# EAGLE design Gadget-Box-mini-pro (EAGLE 6.6.0)

## Sheet 1 of 2
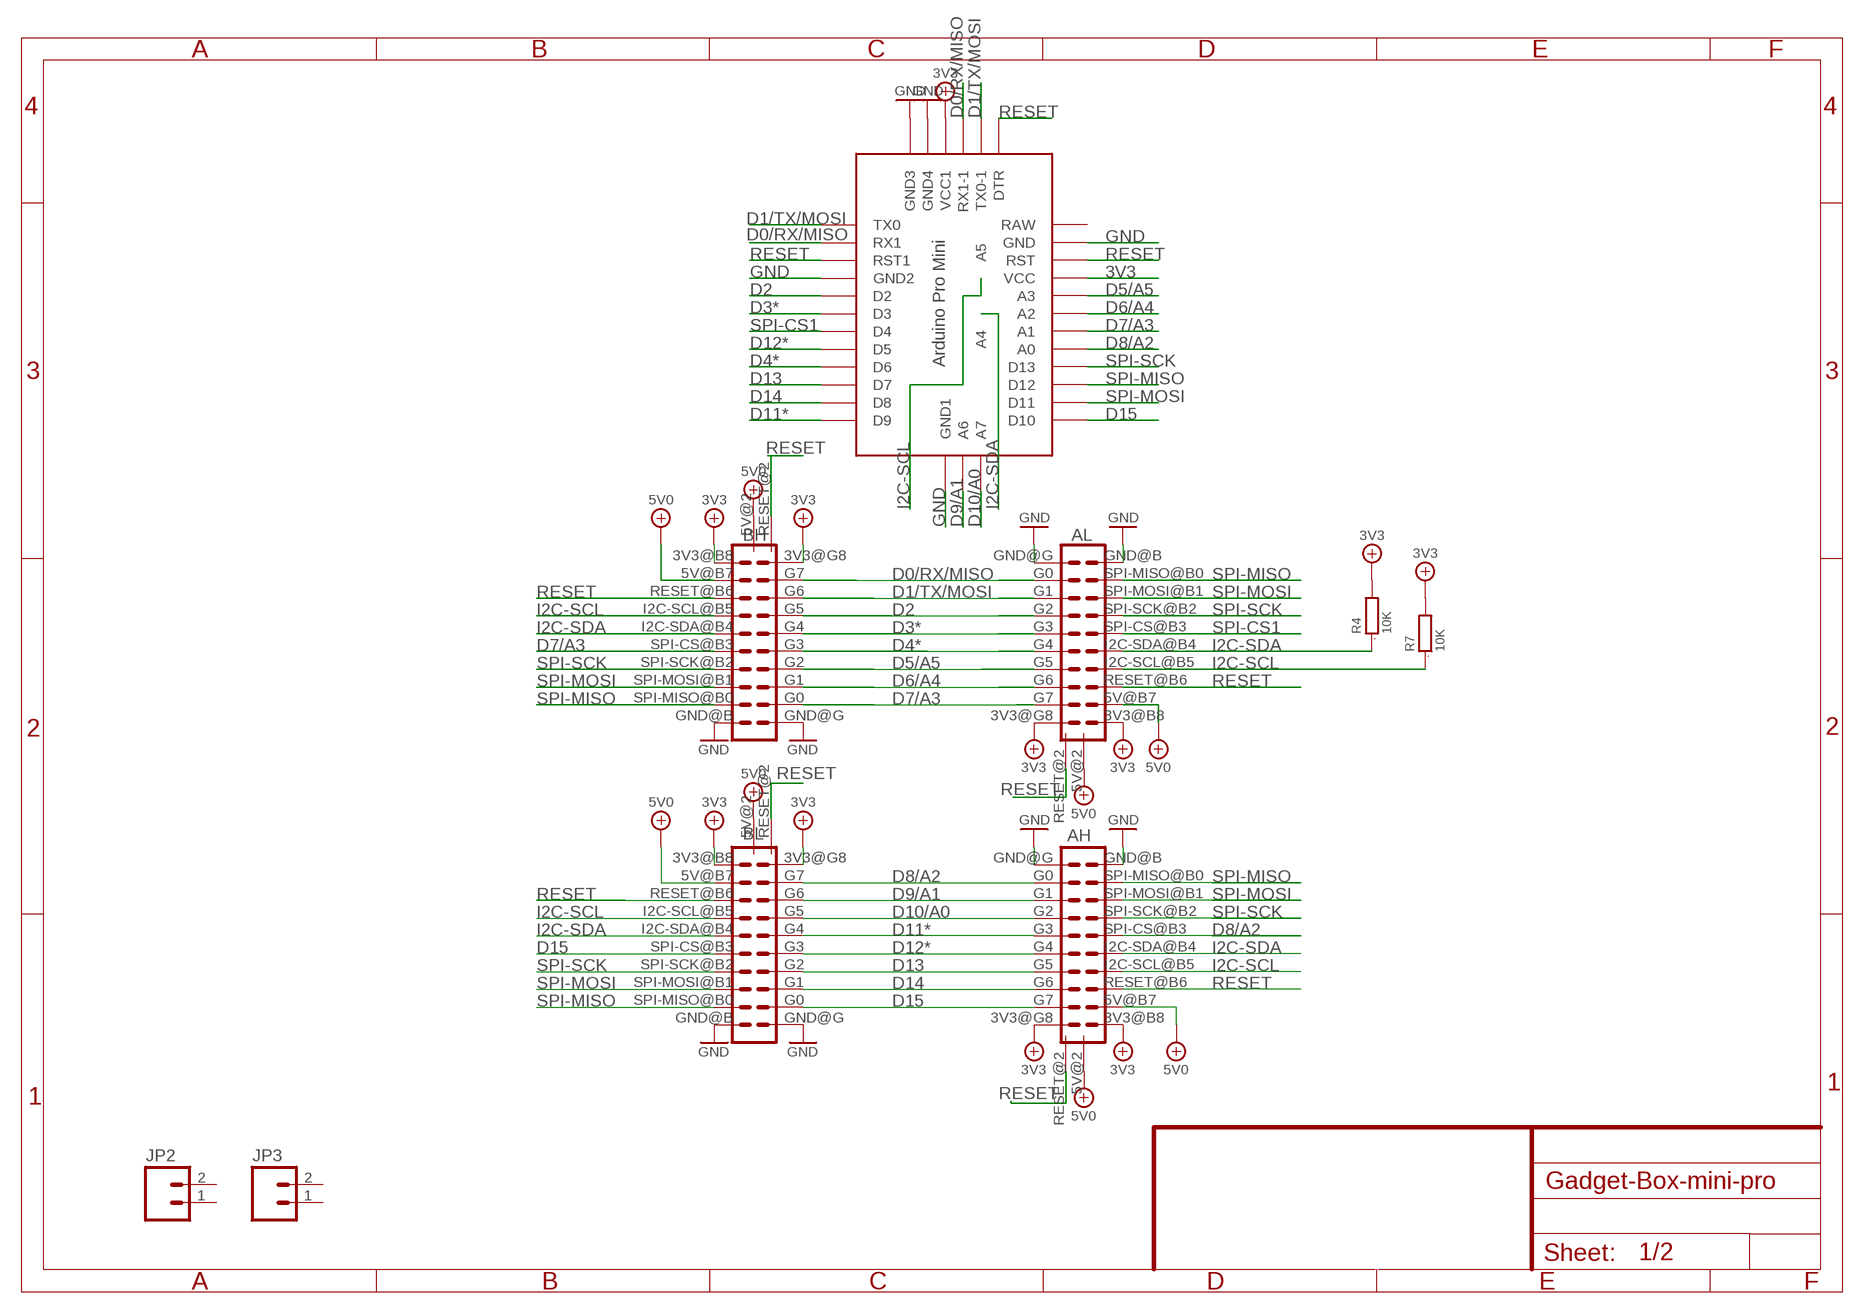
[diagram p0: schematic, sheet 1]

### Parts
AH  ECOGECOG_SLOT_ALT1  [ECOG_ALT1]
AL  ECOGECOG_SLOT_ALT1  [ECOG_ALT1]
BH  ECOGECOG_SLOT_ALT1  [ECOG_ALT1]
BL  ECOGECOG_SLOT_ALT1  [ECOG_ALT1]
JP2  M021X02_NO_SILK  [1X02_NO_SILK]
JP3  M021X02_NO_SILK  [1X02_NO_SILK]
R4  10K  R0805  [0805]
R7  10K  R0805  [0805]
U$1  ABK-PRO-MINI  [ABK-PRO-MINI]

### Nets
3V3: AH.3V3@B8(3V3) AH.3V3@G8(3V3) AL.3V3@B8(3V3) AL.3V3@G8(3V3) BH.3V3@B8(3V3) BH.3V3@G8(3V3) BL.3V3@B8(3V3) BL.3V3@G8(3V3) R4.2 R7.2 U$1.VCC U$1.VCC1 ; also sheet 2
5V0: AH.5V@2(5V) AH.5V@B7(5V) AL.5V@2(5V) AL.5V@B7(5V) BH.5V@2(5V) BH.5V@B7(5V) BL.5V@2(5V) BL.5V@B7(5V) ; also sheet 2
D0/RX/MISO: AL.G0 BH.G7 U$1.RX1 U$1.RX1-1
D1/TX/MOSI: AL.G1 BH.G6 U$1.TX0 U$1.TX0-1
D2: AL.G2 BH.G5 U$1.D2
D3*: AL.G3 BH.G4 U$1.D3
D4*: AL.G4 BH.G3 U$1.D6
D5/A5: AL.G5 BH.G2 U$1.A3 ; also sheet 2
D6/A4: AL.G6 BH.G1 U$1.A2
D7/A3: AL.G7 BH.G0 BH.SPI-CS@B3(SPI-CS) U$1.A1
D8/A2: AH.G0 AH.SPI-CS@B3(SPI-CS) BL.G7 U$1.A0
D9/A1: AH.G1 BL.G6 U$1.A6
D10/A0: AH.G2 BL.G5 U$1.A7
D11*: AH.G3 BL.G4 U$1.D9
D12*: AH.G4 BL.G3 U$1.D5
D13: AH.G5 BL.G2 U$1.D7
D14: AH.G6 BL.G1 U$1.D8
D15: AH.G7 BL.G0 BL.SPI-CS@B3(SPI-CS) U$1.D10
GND [gnd]: AH.GND@B(GND) AH.GND@G(GND) AL.GND@B(GND) AL.GND@G(GND) BH.GND@B(GND) BH.GND@G(GND) BL.GND@B(GND) BL.GND@G(GND) U$1.GND U$1.GND1(GND2) U$1.GND2(GND3) U$1.GND3(GND4) U$1.GND4(GND1) ; also sheet 2
I2C-SCL: AH.I2C-SCL@B5(I2C-SCL) AL.I2C-SCL@B5(I2C-SCL) BH.I2C-SCL@B5(I2C-SCL) BL.I2C-SCL@B5(I2C-SCL) R7.1 U$1.A5
I2C-SDA: AH.I2C-SDA@B4(I2C-SDA) AL.I2C-SDA@B4(I2C-SDA) BH.I2C-SDA@B4(I2C-SDA) BL.I2C-SDA@B4(I2C-SDA) R4.1 U$1.A4
RESET: AH.RESET@2(RESET) AH.RESET@B6(RESET) AL.RESET@2(RESET) AL.RESET@B6(RESET) BH.RESET@2(RESET) BH.RESET@B6(RESET) BL.RESET@2(RESET) BL.RESET@B6(RESET) U$1.DTR U$1.RST U$1.RST1
SPI-CS1: AL.SPI-CS@B3(SPI-CS) U$1.D4
SPI-MISO: AH.SPI-MISO@B0(SPI-MISO) AL.SPI-MISO@B0(SPI-MISO) BH.SPI-MISO@B0(SPI-MISO) BL.SPI-MISO@B0(SPI-MISO) U$1.D12
SPI-MOSI: AH.SPI-MOSI@B1(SPI-MOSI) AL.SPI-MOSI@B1(SPI-MOSI) BH.SPI-MOSI@B1(SPI-MOSI) BL.SPI-MOSI@B1(SPI-MOSI) U$1.D11
SPI-SCK: AH.SPI-SCK@B2(SPI-SCK) AL.SPI-SCK@B2(SPI-SCK) BH.SPI-SCK@B2(SPI-SCK) BL.SPI-SCK@B2(SPI-SCK) U$1.D13
Unconnected: JP2.1 JP2.2 JP3.1 JP3.2 U$1.RAW

## Sheet 2 of 2
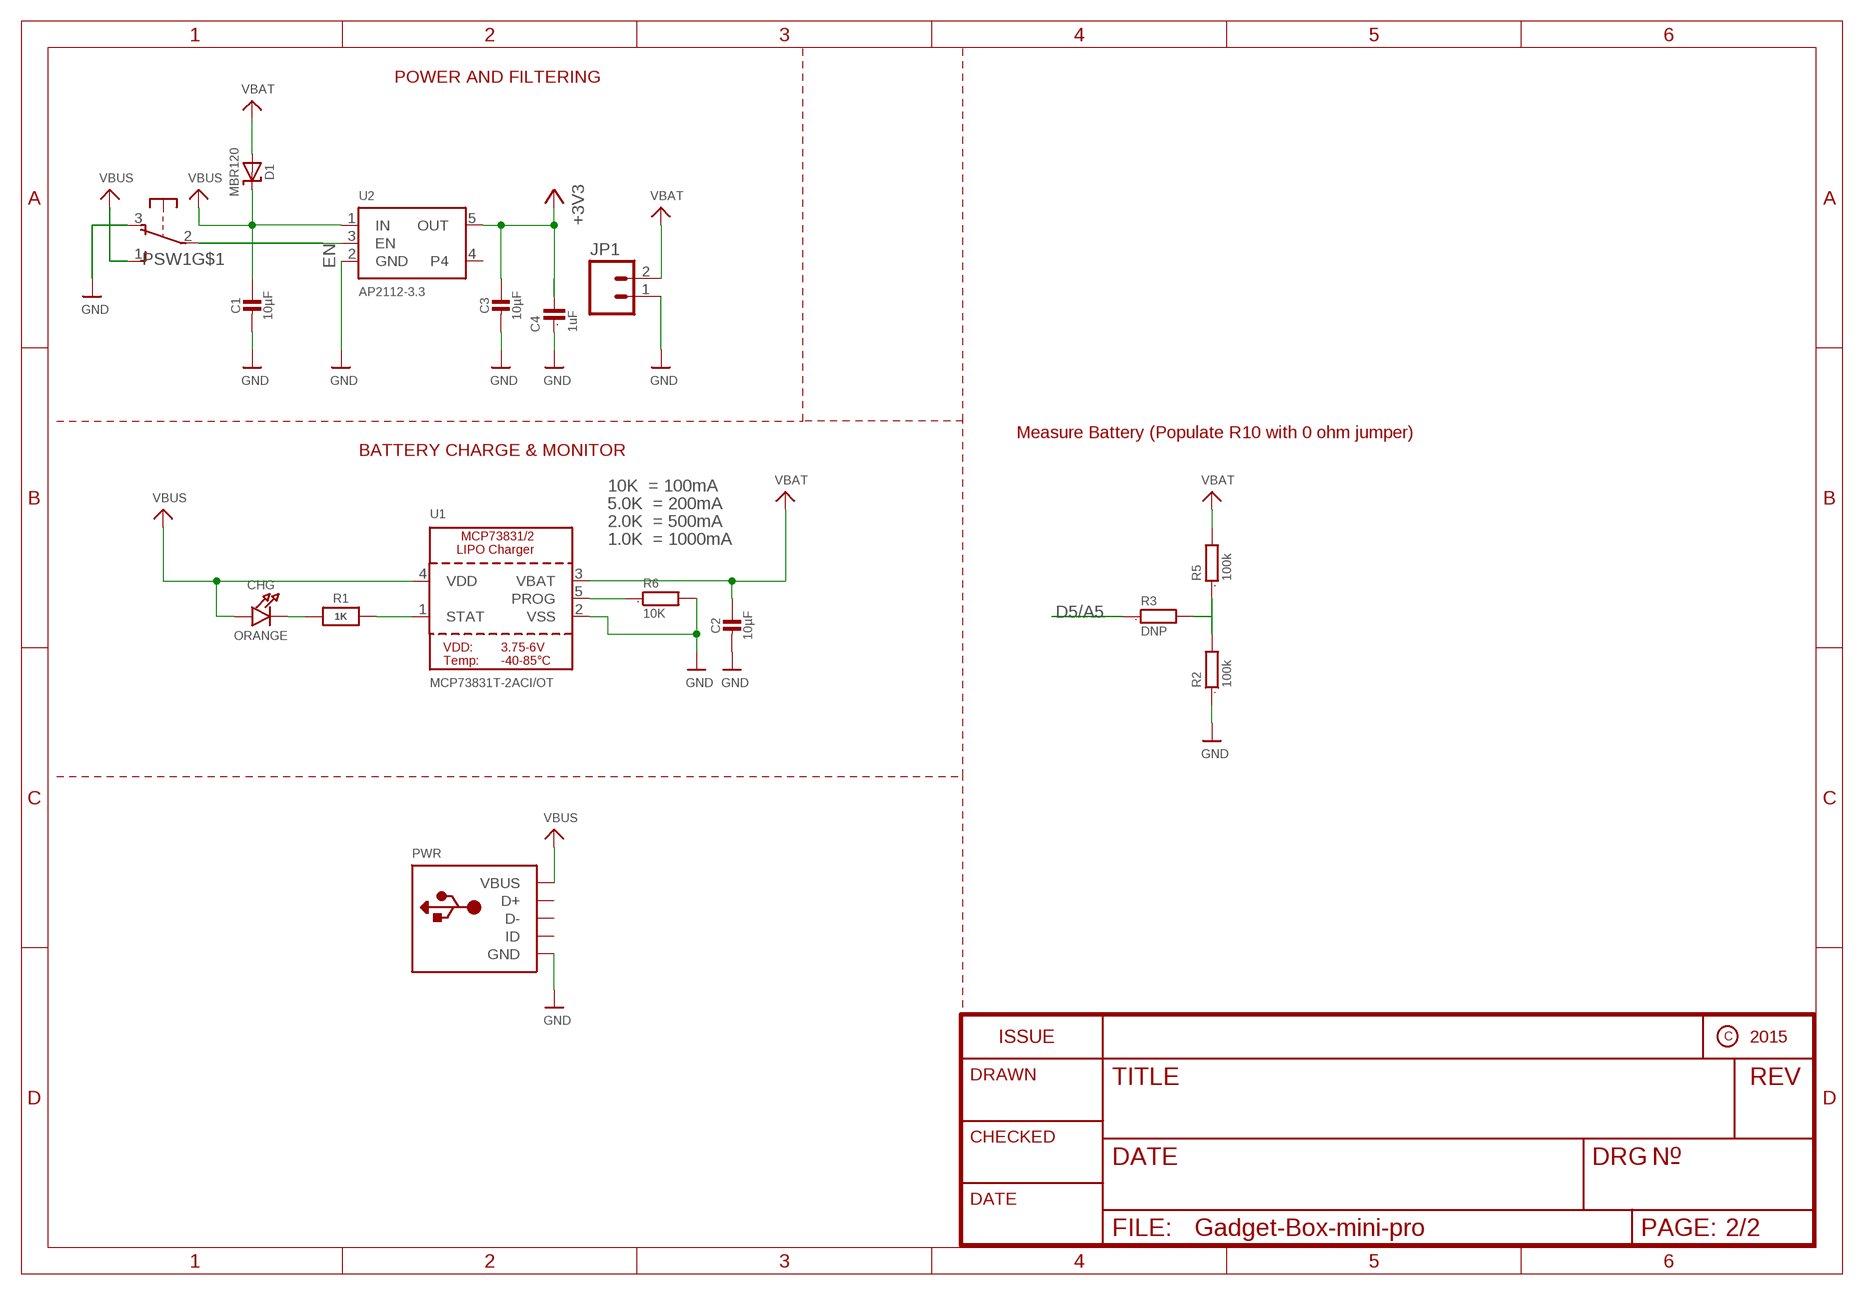
[diagram p1: schematic, sheet 2]

### Parts
C1  10µF  CAP_CERAMIC0805-NOOUTLINE  [0805-NO]
C2  10µF  CAP_CERAMIC0805-NOOUTLINE  [0805-NO]
C3  10µF  CAP_CERAMIC0805-NOOUTLINE  [0805-NO]
C4  1uF  C0603  [0603]
CHG  ORANGE  LED0805_NOOUTLINE  [CHIPLED_0805_NOOUTLINE]
D1  MBR120  DIODE-SCHOTTKYSOD-123  [SOD-123]
JP1  M02-JST-2-PTH-NO_SILK  [JST-2-PTH-NS]
PSW1  OS102011MA1Q  [OS102011MA1Q]
PWR  USBMINIB  [USB-MINIB]
R1  1K  RESISTOR_0603_NOOUT  [0603-NO]
R2  100k  R0603  [0603]
R3  DNP  R0603  [0603]
R5  100k  R0603  [0603]
R6  10K  R0603  [0603]
U1  MCP73831T-2ACI/OT  MCP73831/2  [SOT23-5]
U2  AP2112-3.3  VREG_SOT23-5  [SOT23-5]

### Nets
3V3: C3.1 C4.2 U2.5(OUT) ; supply symbol labelled +3V3 ; also sheet 1
5V0: C1.1 CHG.A D1.C PSW1.1(S) PWR.VBUS U1.4(VDD) U2.1(IN) ; supply symbol labelled VBUS ; also sheet 1
D5/A5: R3.1 ; also sheet 1
EN: PSW1.2(P) U2.3(EN)
GND [gnd]: C1.2 C2.2 C3.2 C4.1 JP1.1 PSW1.3(O) PWR.GND R2.1 R6.2 U1.2(VSS) U2.2(GND) ; also sheet 1
N$1: CHG.C R1.1
N$2: R2.2 R3.2 R5.1
N$3: R1.2 U1.1(STAT)
N$4: R6.1 U1.5(PROG)
VBAT: C2.1 D1.A JP1.2 R5.2 U1.3(VBAT)
Unconnected: PSW1.MT1(MT) PSW1.MT2(MT) PWR.D+ PWR.D- PWR.ID U2.4

### Notes on the sheet
- POWER AND FILTERING
- Measure Battery (Populate R10 with 0 ohm jumper)
- BATTERY CHARGE & MONITOR
- 10K  = 100mA
- 5.0K  = 200mA
- 2.0K  = 500mA
- 1.0K  = 1000mA

## Library data of the parts
AH AL BH BL = eCogs:ECOG; PARTNO: PPPC102LFBN-RC,SULLINS CONNECTOR SOLUTIONS,dk,S6106-ND,"CONN HEADER FEM 20POS.1"" DL GOLD", REF67
C1-C3 = microbuilder:CAP_CERAMIC: Ceramic Capacitors For new designs, use the packages preceded by an '_' character since they are more reliable: The following footprints should be used on most boards: _0402 - Standard footprint for regular board layouts _0603 - Standard footprint for regular board layouts _0805 - Standard footprint for regular board layouts _1206 - Standard footprint for regular board layouts For extremely tight-pitch boards where space is at a premium, the following 'micro-pitch' footprints can be used (smaller pads, no silkscreen outline, etc.): _0402MP - Micro-pitch footprint for very dense/compact boards _0603MP - Micro-pitch footprint for very dense/compact boards _0805MP - Micro-pitch footprint for very dense/compact boards _1206MP - Micro-pitch footprint for very dense/compact boards; PARTNO: CL21F106ZPFNNNE,Samsung,DK,1276-3012-1-ND,CAP CER 10UF 10V Y5V 0805, REF1
C4 = GadgetFactory:C: CAPACITOR, European symbol; PARTNO: C1608X5R1A105K080AC,TDK CORPORATION (VA),dk,445-1321-1-ND,CAP CER 1UF 10V X5R 0603, REF53
CHG = microbuilder:LED: LED 0603 - 0603 Surface Mount Package 2mA: Green LED - Low Power (3.9mcd, 2ma, 1.7Vf) - Digikey: 475-2709-2-ND Orange LED - Low Power (9.8mcd, 2ma, 1.8Vf) - Digikey: 475-1194-2-ND Red LED - Low Power (5mcd, 2ma, 1.8Vf) - Digikey: 475-1195-2-ND Yellow LED - Low Power (7mcd, 2ma, 1.8Vf) - Digikey: 475-1196-2-ND 5mA: Blue LED - Low Power (17mcd, 5ma, 2.9Vf) - Digikey: LNJ937W8CRACT-ND 0805 - 0805 Surface Mount Package 2mA: Red LED (8.8mcd, 2mA, 1.8Vf, Clear) - Low Power [Digikey: 475-2510-1-ND] Green LED (5mcd, 2mA, 1.8Vf, Clear) - Low Power [Digikey: 475-2730-1-ND] Yellow LED (11.3mcd, 2mA, 1.8Vf, Clear) - Low Power [Digikey: 475-2555-1-ND] 20mA: Red LED (104mcd, 20mA, Diffused) - LS R976 [Digikey: 475-1278-6-ND] Red LED (12mcd, 20mA, 2.0Vf, Clear) - APT2012EC [Digikey: 754-1128-1-ND] Green LED (15mcd, 20mA, 2.2Vf, Clear) - APT2012GC [Digikey: 754-1131-1-ND] Orange LED (160mcd, 20mA, 2.1Vf, Clear) - APT2012SECK [Digikey: 754-1130-1-ND] 1206 - 1206 Surface Mount Package Green LED (26mcd, 20mA, Diffused) - LG N971 [Digikey: 475-1407-6-ND] Red LED (15mcd, 20mA, Diffused) - LH N974 [Digikey: 475-1416-6-ND] Cree - Cree High-Power Surface Mount LEDs XPEBWT-L1-0000-00D50 - White 111lm 350mA 2.9Vf 6200K 110° XTEAWT-00-0000-00000LEE3 - White 114lm 350mA 2.85Vf 5000K 115° Everlight - Everlight 45-21 Series Surface Mount LEDs 45-21/QK2C-B2832AC2CB2/2T - Warm White 2000mcd 20mA 3.25Vf 3050K 120° 45-21/LK2C-B38452C4CB2/2T - Nuetral White 2000mcd 20mA 3.25Vf 4150K 120° 45-21/LK2C-B50634C6CB2/2T - Cold White 2200mcd 20mA 3.25Vf 5650K 120° PLCC2 Reverse Mount LS T77K-J1L2-1-0-2-R18-Z - Red 11.25mcd 2mA 1.8Vf 630nm 120° LO T77K-L1M2-24-Z - Orange 19.6mcd 2mA 1.8Vf 606nm 120° LY T77K-K2M1-26-Z - Yellow 15.7mcd 2mA 1.8Vf 587nm 120°; PARTNO: LTST-C171EKT,LITE-ON INC (VA),DK,160-1422-1-ND,LED RED ORAN CLEAR THIN 0805 SMD, REF6
D1 = microbuilder:DIODE-SCHOTTKY; PARTNO: MBR120VLSFT3G,on semiconductor,dk,MBR120VLSFT3GOSCT-ND ,DIODE SCHOTTKY 20V 1A SOD123FL , REF71
JP1-JP3 = SparkFun:M02: Header 2 Standard 2-pin 0.1" header. Use with straight break away headers (SKU : PRT-00116), right angle break away headers (PRT-00553), swiss pins (PRT-00743), machine pins (PRT-00117), and female headers (PRT-00115). Molex polarized connector foot print use with SKU : PRT-08233 with associated crimp pins and housings.
PSW1 = adafruit:OS102011MA1Q: OS10201MA1Q through-hole right angle switch http://www.ladyada.net/library/eagle; PARTNO: OS102011MA1QN1,C&K Components,dk,CKN9559-ND,SWITCH SLIDE SPDT 100MA 12V , REF72
PWR = adafruit:USB: USB Connectors USBMINIB - Surface Mount Female Mini-B USB Connector 4UConnector: 06564 By microbuilder.eu Thru-hole RA Female Mini-B USB Connector 4UConnector: 18732 By ladyada.net
R1 = microbuilder:RESISTOR: Resistors For new designs, use the packages preceded by an '_' character since they are more reliable: The following footprints should be used on most boards: _0402 - Standard footprint for regular board layouts _0603 - Standard footprint for regular board layouts _0805 - Standard footprint for regular board layouts _1206 - Standard footprint for regular board layouts For extremely tight-pitch boards where space is at a premium, the following 'micro-pitch' footprints can be used (smaller pads, no silkscreen outline, etc.): _0402MP - Micro-pitch footprint for very dense/compact boards _0603MP - Micro-pitch footprint for very dense/compact boards _0805MP - Micro-pitch footprint for very dense/compact boards _1206MP - Micro-pitch footprint for very dense/compact boards; PARTNO: RC0603JR-071KL,YAGEO (VA),dk,311-1.0KGRTR-ND,RES SMD 1K OHM 5% 1/10W 0603 , REF73
R2 R5 = GadgetFactory:R: RESISTOR, European symbol; PARTNO: RC0603JR-07100KL,YAGEO (VA),dk,311-100KGRCT-ND,RES SMD 100K OHM 5% 1/10W 0603 , REF76
R3 = GadgetFactory:R: RESISTOR, European symbol; BOM: EXCLUDE
R4 R7 = GadgetFactory:R: RESISTOR, European symbol
R6 = GadgetFactory:R: RESISTOR, European symbol; PARTNO: RC0603JR-0710KL,YAGEO (VA),dk,311-10KGRCT-ND,RES SMD 10K OHM 5% 1/10W 0603 , REF36
U1 = microbuilder:MCP73831/2: MCP73831/2 LIPO Charger VDD: 3.75 - 6V Temp -40 - 85°C Programmable Charge Rate: 15-500mA NOTE: STAT is a tri-state logic output on the MCP73831 and an open-drain output on the MCP73832. SOT23-5 with 4.2V output and tri-state logic on STAT = MCP73831T-2ACI/OT; PARTNO: MCP73831T-2ACI/OT,MICROCHIP TECHNOLOGY (VA),dk,MCP73831T-2ACI/OTCT-ND,IC CONTROLLR LI-ION 4.2V SOT23-5, REF74
U2 = microbuilder:VREG_SOT23-5: SOT23-5 Fixed Voltage Regulators Part Current Out V Out V In V Dropout θJA (°C/W) TJ (°C) Digikey Part No. ADP121 150mA 3.3V 3.4-5.5V 0.09V @ 150mA -- -- ADP121-AUJZ33R7CT-ND ADP121 150mA 3.0V 3.1-5.5V 0.09V @ 150mA -- -- ADP121-AUJZ30R7CT-ND ADP122 300mA 3.3V 3.4-5.5V 0.085V @ 300mA -- -- ADP122AUJZ-3.3-R7CT-ND ADP1712 300mA 3.3V 3.5-5.5V 0.17V @ 300mA -- -- ADP1712AUJZ-3.3-R7TR-ND AP7311 (Low Cost) 150mA 3.3V 3.5-6V 0.15V @ 150mA -- -- AP7311-33WG-7DICT-ND LD39015M18R 150mA 1.8V 1.9V-5.5V 0.08V @ 100mA -- -- 497-6977-1-ND LP2985A-33DBVR 150mA 3.3V 3.3-16V 0.28V @ 150mA 206 150 296-18479-1-ND MCP1824T-3302E/OT 300mA 3.3V 3.5V-6V 0.2V @ 300mA -- -- MCP1824T-3302E/OTCT-ND MIC5205-2.5YM5 TR 150mA 2.5V 2.7-16V 0.165V @ 150mA -- -- 576-1257-2-ND MIC5205-3.0YM5 TR 150mA 3.0V 3.2V-16V 0.165V @ 150mA -- -- 576-1258-2-ND MIC5205-3.3YM5 TR 150mA 3.3V 3.5V-16V 0.165V @ 150mA -- -- 576-1259-2-ND TPS780330220 150mA 3.3V+2.2V 3.6-5.5V 250mV Max -- -- 296-23332-1-ND TDA3663/N1,135 100mA 3.3V 3.5-45V 0.18V @ 50mA -- -- 568-5343-1-ND Max operating temp can be calculated using θJA, TJ (max junction temperature), and power in watts. Set the "Maximum Ambient Temperature" until it reaches TJ ("Max Junction Temperature"), which is the absolute limit for safe use of the regulator: Heat Sink Temperature Calculator <http://www.daycounter.com/Calculators/Heat-Sink-Temperature-Calculator.phtml> For example, With 12V source into a 3.3V LP2985 and a 30mA load, we are dissipating (12V-3.3V) * 0.03A = 0.261W. With a θJA of 206 °C/W, a TJ of 150°C, and 261mW we can safely use the chip without a heat sink up to 75°C (=147.1°C Junction Temperature).; PARTNO: AP2112K-3.3TRG1,Diodes Incorporated,dk,AP2112K-3.3TRG1DICT-ND,IC REG LDO 3.3V 0.6A SOT25 , REF75
U$1 = Arduino-clone:ABK-PRO-MINI: ABK Pro-Mini Arduino Clone; BOM: EXCLUDE

## Net classes
2 gnd: width 0.254 mm, drill 0.381 mm, clearance 0.254 mm
3 usbvcc: width 0.254 mm, drill 0.381 mm, clearance 0.254 mm
4 aref: width 0.254 mm, drill 0.381 mm, clearance 0.254 mm

## Board
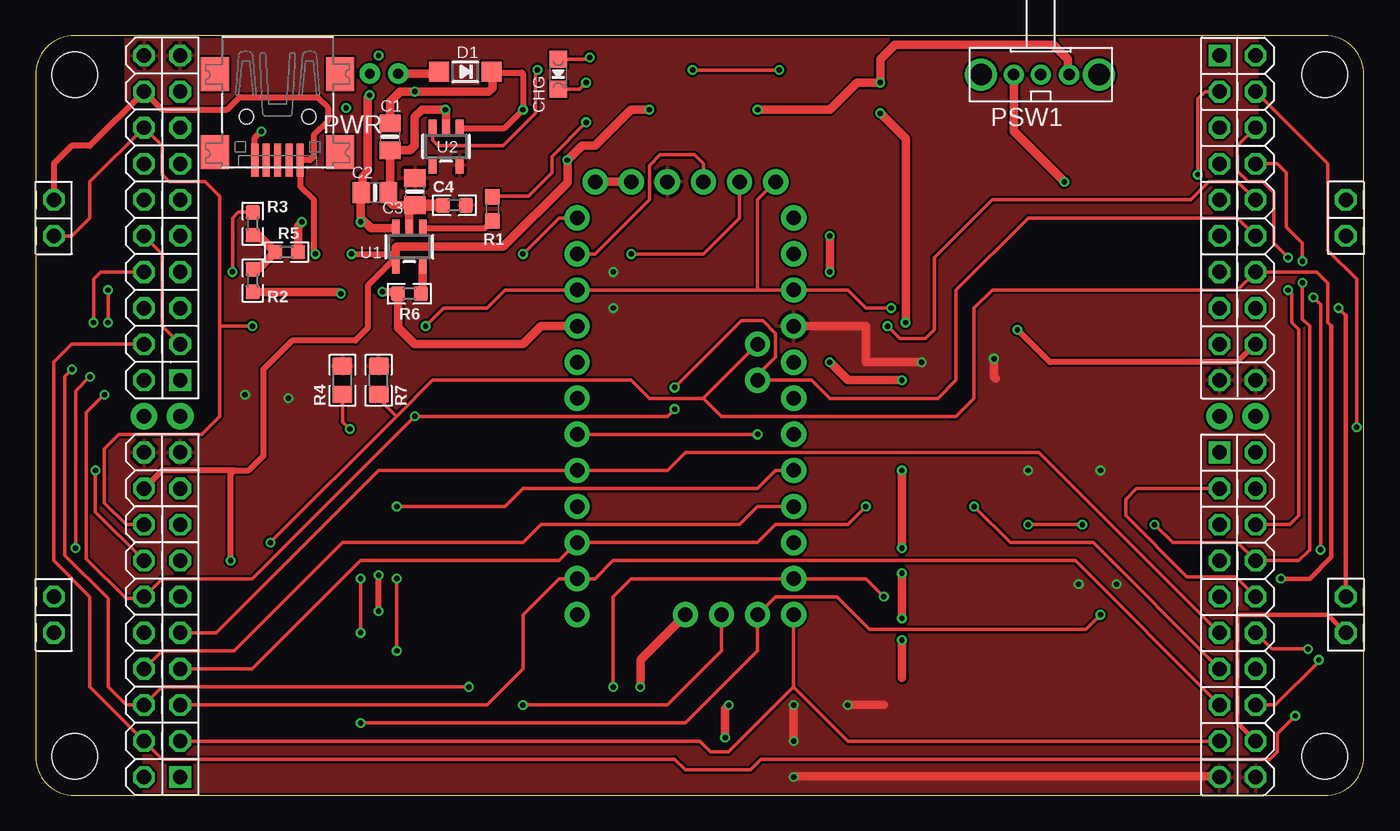
[diagram p2: board, top side]
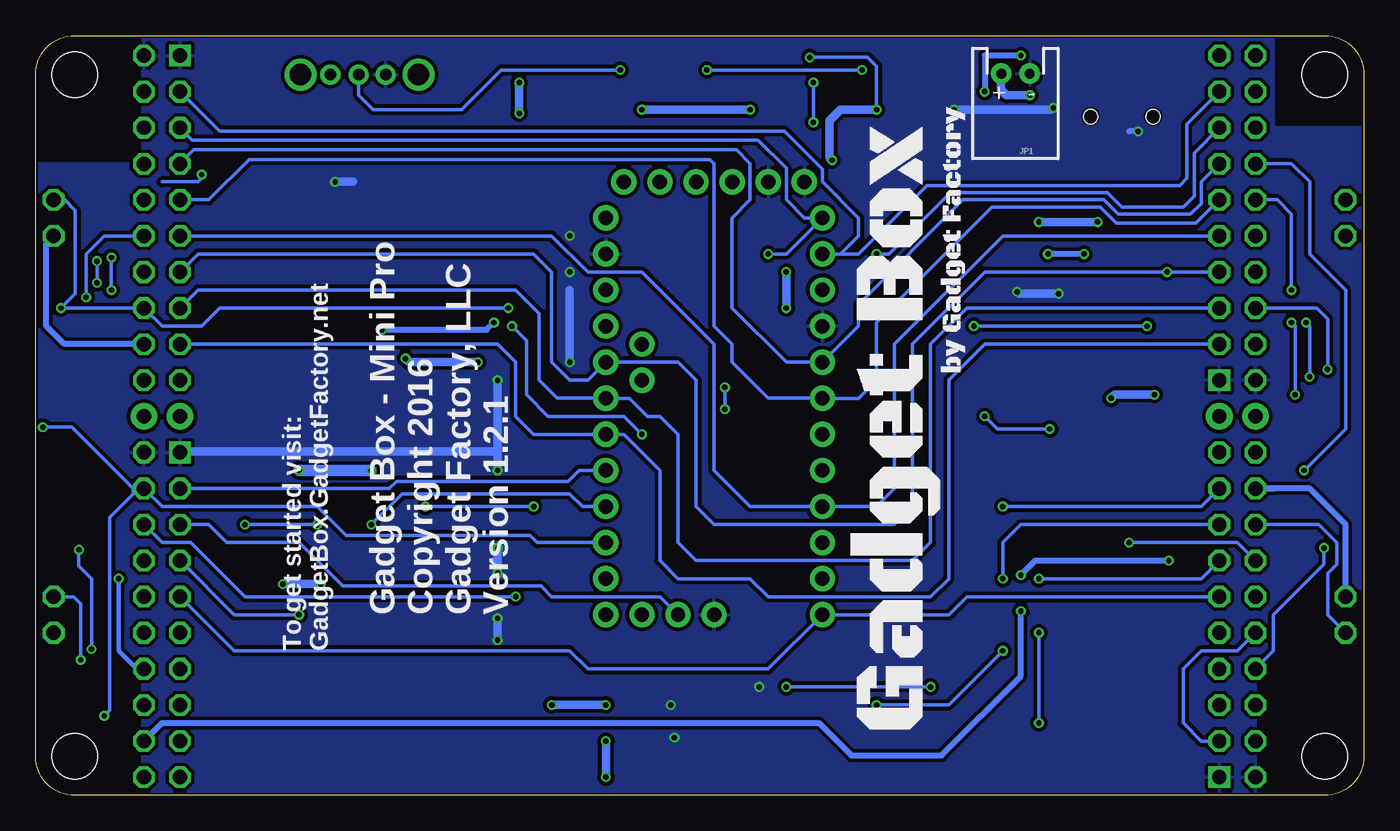
[diagram p3: board, bottom side, seen from below]

Size 93.5 x 53.5 mm. Coordinates in mm from the lower left corner, seen from the top.
Copper layers (1*16): Top 0.035mm / dielectric 1.5mm / Bottom 0.035mm
Design rules "hackvana *": minimum track width 6mil, minimum drill 0.3mm, track to track 6mil, track to pad 6mil, pad to pad 6mil, via to via 6mil, smd to smd 0mil, copper to edge 6mil, drill to drill 6mil, minimum pad ring 10mil, minimum via ring 6mil, stop-mask expansion 2mil, vias tented up to drill 100mil, thermal gap 10mil

### Footprints (pad centres in the part's own frame; a part is rotated, then mirrored left to right if it is on the bottom)
ECOG93P53P5 = hole 3.2: 4,4; 92,4; 92,52; 4,52
ECOG_ALT1 = drill 1.016 octagon: 3V3@B8 21.59,3.81; 3V3@G8 21.59,1.27; 5V@2 11.43,10.16; 5V@B7 19.05,3.81; G0 1.27,1.27; G1 3.81,1.27; G2 6.35,1.27; G3 8.89,1.27; G4 11.43,1.27; G5 13.97,1.27; G6 16.51,1.27; G7 19.05,1.27; GND@B -1.27,3.81; I2C-SCL@B5 13.97,3.81; I2C-SDA@B4 11.43,3.81; RESET@2 8.89,10.16; RESET@B6 16.51,3.81; SPI-CS@B3 8.89,3.81; SPI-MISO@B0 1.27,3.81; SPI-MOSI@B1 3.81,3.81; SPI-SCK@B2 6.35,3.81 | drill 1.016 square: GND@G -1.27,1.27
0805-NO = smd 1.24 x 1.5: 1 -0.95,0; 2 0.95,0
0603 = smd 1 x 1: 1 -0.8,0; 2 0.8,0
CHIPLED_0805_NOOUTLINE = smd 1.2 x 1.2: A 0,-1.05; C 0,1.05
SOD-123 = smd 1.4 x 1.4: A 1.85,0; C -1.85,0
JST-2-PTH-NS = drill 0.7 pad 1.448: 1 -1,0; 2 1,0
1X02_NO_SILK = drill 1.016 pad 1.88: 1 0,0; 2 2.54,0
OS102011MA1Q = drill 0.8 pad 1.422: 1 -2,0; 2 0,0; 3 1.9,0 | drill 1.5 pad 2.184: MT1 -4.1,0; MT2 4.2,0
USB-MINIB = smd 0.5 x 2.308: D+ 0,4.064; D- -0.8,4.064; GND 1.6,4.064; ID 0.8,4.064; VBUS -1.6,4.064 | smd 2 x 2.4: GND1 -4.4,-2; GND2 -4.4,3.5; GND3 4.4,3.5; GND4 4.4,-2 | hole 1: -2.2,1; 2.2,1
0603-NO = smd 1.1 x 1: 1 -0.85,0; 2 0.85,0
0805 = smd 1.2 x 1.4: 1 -1,0; 2 1,0
SOT23-5 = smd 0.55 x 1.2: 1 -0.95,-1.3; 2 0,-1.3; 3 0.95,-1.3; 4 0.95,1.3; 5 -0.95,1.3
ABK-PRO-MINI = drill 1.016 pad 1.778: A0 10.16,-11.43; A1 10.16,-8.89; A2 10.16,-6.35; A3 10.16,-3.81; A4 7.62,-5.08; A5 7.62,-2.54; A6 5.08,-21.59; A7 7.62,-21.59; D2 -5.08,-3.81; D3 -5.08,-6.35; D4 -5.08,-8.89; D5 -5.08,-11.43; D6 -5.08,-13.97; D7 -5.08,-16.51; D8 -5.08,-19.05; D9 -5.08,-21.59; D10 10.16,-21.59; D11 10.16,-19.05; D12 10.16,-16.51; D13 10.16,-13.97; DTR 8.89,8.89; GND 10.16,3.81; GND1 -5.08,-1.27; GND2 -3.81,8.89; GND3 -1.27,8.89; GND4 2.54,-21.59; RAW 10.16,6.35; RST 10.16,1.27; RST1 -5.08,1.27; RX1 -5.08,3.81; RX1-1 3.81,8.89; TX0 -5.08,6.35; TX0-1 6.35,8.89; VCC 10.16,-1.27; VCC1 1.27,8.89

### Placement (x,y rotation side)
$$U$1  [ECOG93P53P5]  -1.25,-1.25 0 top
AH  82.06,22.88 270 top
AL  82.06,50.82 270 top
BH  11.45,30.5 90 top
BL  11.45,2.56 90 top
C1  24.95,46.37 270 top
C2  23.9,42.44 0 top
C3  26.7,42.51 270 top
C4  29.48,41.55 0 top
CHG  36.79,50.78 180 top
D1  30.25,50.95 180 top
JP1  24.53,50.82 180 bottom
JP2  7.64,26.69 0 top
JP3  83.33,26.69 0 top
PSW1  70.75,50.75 180 top
PWR  17.04,48.79 180 top
R1  32.15,41.3 270 top
R2  15.29,36.25 90 top
R3  15.29,40.25 270 top
R4  21.61,29.23 90 top
R5  17.67,38.25 0 top
R6  26.31,35.33 180 top
R7  24.15,29.23 90 top
U1  26.31,38.63 180 top
U2  28.9,45.69 180 top
U$1  43.2,34.31 0 top
U$100  [GADGETBOX_TEXT]  32.79,25.93 90 bottom

### Tracks (layer width: path | path; a pad name or v marks a point on that pad's centre or on a via)
3V3  (via drill 0.38)
  Top 0.61: v67.46,30.75 67.46,29.48 67.58,29.36 | v53.36,1.29 53.41,1.34 83.28,1.34 AH.3V3@G8 | v53.36,3.83 v53.36,6.37 | v57.17,6.37 59.71,6.37 | U$1.VCC 58.44,33.04 58.44,30.5 v62.38,30.5
  Bottom 0.61: v62.38,30.5 67.2,30.5 v67.46,30.75 | v53.36,1.29 v53.36,3.83 | v53.36,6.37 v57.17,6.37 | v73.43,14.88 v76.09,14.88 | v14.75,28.21 17.55,28.21 v17.8,27.96 | v40.66,36.85 v40.66,34.31
  Bottom 0.813: v74.95,22.88 v69.87,22.88
  pour Top: -1.25,8.37 -1.25,47.03 6.37,47.03 6.37,54.63 85.95,54.63 85.95,45.01 94.92,45.01 94.92,8.37 85.95,8.37 85.95,-1.25 7.64,-1.25 7.64,8.37
5V0  (via drill 0.38)
  Top 0.254: CHG.A 38.87,51.83 v39.01,51.96
  Top 0.305: AH.5V@B7 84.6,5.1 84.6,12.72 90.95,12.72 AH.5V@2
  Top 0.406: U2.1 33.02,46.99 v34.31,48.28 34.31,50.82 34.24,50.89 32.15,50.89 | 13.99,22.88 15.01,22.88 16.02,23.9 16.02,29.99 18.05,32.02 22.5,32.02 23.39,32.91 23.39,35.9 25.33,37.83 | 25.33,37.83 25.36,37.87 | v24.15,12.97 v24.15,15.51 | v13.74,16.53 13.74,22.63 13.99,22.88 | v69.11,32.79 71.39,30.5 84.6,30.5 AL.5V@B7 | 13.99,22.88 8.91,22.88 BL.5V@B7 | BH.5V@2 1.29,44.47 2.56,45.74 3.83,45.74 BH.5V@B7 8.91,48.28 13.48,48.28 14.37,49.17 19.83,49.17 20.59,48.41 20.59,47.52 19.58,46.5 19.58,44.98 19.32,44.72 PWR.VBUS 18.64,42.87 19.58,41.93 19.58,38.25 v19.7,38.12 | v22.25,38.12 25.04,38.12 25.33,37.83
  Top 0.61: U1.4 25.36,37.87 25.36,38.57 25.42,38.63 32.91,38.63 37.43,43.15 v37.43,44.72 38.45,45.74 39.39,45.74 41.93,48.28 v43.2,48.28 | C1.1 24.95,48.83 25.67,49.55 v26.69,49.55 31.9,49.55 32.15,49.8 32.15,50.89 D1.C | v61.23,33.29 61.25,33.31 61.25,46.23 v59.46,48.03 | PSW1.1 72.66,50.84 72.66,51.84 71.65,52.85 60.47,52.85 59.46,51.84 v59.46,50.19 57.8,50.19 55.9,48.28 v50.82,48.28
  Bottom 0.254: v39.01,51.96 34.95,51.96 34.31,51.33 v34.31,48.28
  Bottom 0.406: v24.15,52.09 26.69,52.09 v26.69,49.55 | v69.11,32.79 61.74,32.79 v61.23,33.29 | v24.15,12.97 24.15,8.4 29.74,2.81 36.09,2.81 38.37,5.1 84.6,5.1 AH.5V@B7 | v24.15,15.51 23.13,16.53 v13.74,16.53 | 6.37,21.61 BL.5V@B7 3.83,21.61 1.29,19.07 BL.5V@2 | AL.5V@B7 85.93,31.83 91.52,31.83 92.73,33.04 92.73,38.88 AL.5V@2 | v19.7,38.12 v22.25,38.12
  Bottom 0.61: v34.31,48.28 36.85,48.28 37.61,47.52 37.61,44.9 v37.43,44.72 | v59.46,48.03 v59.46,50.19 | v50.82,48.28 v43.2,48.28
D0/RX/MISO  (via drill 0.38)
  Top 0.254: v81.81,43.71 81.81,49.04 82.32,49.55 AL.G0 | U$1.RX1 39.39,38.12 43.2,41.93 43.2,44.34 43.96,45.1 46.38,45.1 47.01,44.47 U$1.RX1-1
  Bottom 0.254: 9.96,49.55 BH.G7 12.47,47.26 12.47,43.45 12.97,42.95 30.75,42.95 35.58,38.12 36.85,38.12 | v81.81,43.71 81.81,43.45 82.06,43.2 84.6,43.2 | AL.G0 80.54,46.76 40.79,46.76 38.12,44.09 38.12,43.2 35.58,40.66 35.58,39.39 36.85,38.12 | 36.85,38.12 U$1.RX1
D1/TX/MOSI  (via drill 0.38)
  Top 0.254: v34.31,38.12 36.85,40.66 U$1.TX0 | U$1.TX0-1 49.55,40.66 47.01,38.12 v41.93,38.12
  Bottom 0.254: 9.96,47.01 BH.G6 11.96,45.23 11.96,42.18 12.72,41.42 17.04,41.42 18.05,42.44 29.1,42.44 33.42,38.12 v34.31,38.12 | AL.G1 82.47,46.15 42.65,46.15 40.66,44.16 40.66,41.93 39.39,40.66 U$1.TX0 39.39,39.39 40.66,38.12 v41.93,38.12
D2
  Bottom 0.254: 9.96,44.47 BH.G5 11.45,43.2 11.45,41.68 12.21,40.91 17.29,40.91 18.31,41.93 28.21,41.93 35.58,34.56 35.58,33.04 U$1.D2 40.66,30.5 44.47,34.31 44.47,40.66 43.2,41.93 43.2,44.47 44.18,45.45 82.35,45.45 AL.G2
D3*
  Bottom 0.254: 9.96,41.93 BH.G4 11.83,40.28 17.42,40.28 18.56,41.42 26.18,41.42 34.31,33.29 34.31,29.23 35.58,27.96 U$1.D3 41.93,27.96 44.47,30.5 44.47,31.77 45.74,33.04 45.74,44.47 46.02,44.75 78.48,44.75 81.3,41.93 AL.G3
D4*
  Bottom 0.254: 9.96,39.39 BH.G3 25.42,39.39 33.04,31.77 33.04,21.61 34.31,20.34 U$1.D6 43.2,20.34 45.74,22.88 45.74,31.77 50.82,36.85 54.63,36.85 57.17,39.39 AL.G4
D5/A5  (via drill 0.38)
  Top 0.254: R3.1 14.25,41.05 13.86,40.66 v13.86,36.85
  Bottom 0.254: 9.96,36.85 BH.G2 v13.86,36.85 26.69,36.85 31.77,31.77 31.77,20.34 33.04,19.07 45.74,19.07 47.01,20.34 47.01,29.23 48.28,30.5 U$1.A3 54.63,29.23 55.9,29.23 57.17,30.5 57.17,36.85 58.44,38.12 82.06,38.12 AL.G5
D6/A4
  Bottom 0.254: 9.96,34.31 BH.G1 27.96,34.31 30.5,31.77 30.5,17.8 31.77,16.53 47.01,16.53 48.28,17.8 48.28,25.42 49.55,26.69 50.44,26.69 51.71,27.96 U$1.A2 56.79,27.96 58.06,29.23 58.06,33.93 59.71,35.58 82.06,35.58 AL.G6
D7/A3
  Top 0.254: BH.SPI-CS@B3 8.91,38.12 8.91,33.04 BH.G0
  Bottom 0.254: AL.G7 60.98,31.77 59.71,30.5 59.71,26.69 58.44,25.42 U$1.A1 52.09,25.42 49.55,22.88 49.55,16.53 48.28,15.26 43.2,15.26 41.93,13.99 30.5,13.99 29.23,15.26 29.23,29.23 26.69,31.77 BH.G0 9.96,31.77
D8/A2  (via drill 0.38)
  Top 0.254: AH.G0 77.49,21.61 76.73,20.85 76.73,19.7 81.05,15.39 84.47,15.39 AH.SPI-CS@B3 | v25.42,20.34 33.04,20.34 34.31,21.61 50.82,21.61 52.09,22.88 U$1.A0
  Bottom 0.254: v25.42,20.34 11.45,20.34 BL.G7 | AH.G0 68.6,21.61 68.09,22.12 56.03,22.12 55.26,22.88 U$1.A0
D9/A1  (via drill 0.38)
  Top 0.254: v34.31,6.37 44.47,6.37 48.28,10.18 U$1.A6 | v25.42,10.18 v25.42,15.26
  Bottom 0.254: v34.31,6.37 29.23,6.37 v25.42,10.18 | v25.42,15.26 25.42,17.8 24.15,19.07 BL.G6 9.98,19.07 | AH.G1 81.3,19.07 80.03,17.8 74.95,17.8 71.9,14.75 57.93,14.75 57.17,13.99 49.55,13.99 U$1.A6
D10/A0  (via drill 0.38)
  Top 0.254: v22.88,5.1 45.74,5.1 50.82,10.18 U$1.A7 52.09,13.99 56.41,13.99 58.69,11.7 73.93,11.7 v74.95,12.72 | v22.88,11.45 v22.88,15.26
  Bottom 0.254: v22.88,5.1 v22.88,11.45 | v22.88,15.26 11.45,15.26 BL.G5 | v74.95,12.72 79.52,12.72 AH.G2
D11*
  Bottom 0.254: 9.98,13.99 BL.G4 27.96,13.99 29.23,12.72 U$1.D9 41.93,8.91 54.63,8.91 55.9,10.18 79.52,10.18 AH.G3
D12*
  Top 0.254: 9.98,11.45 BL.G3 12.72,11.45 24.15,22.88 U$1.D5 44.47,22.88 45.74,24.15 70.63,24.15 AH.G4
D13  (via drill 0.38)
  Top 0.254: 9.98,8.91 BL.G2 15.26,8.91 22.88,16.53 36.85,16.53 U$1.D7 50.82,17.8 52.09,19.07 57.17,19.07 v58.44,20.34 | v66.06,20.34 68.6,17.8 74.44,17.8 AH.G5
  Bottom 0.254: v58.44,20.34 v66.06,20.34
D14
  Top 0.254: 9.98,6.37 BL.G1 31.77,6.37 34.31,8.91 34.31,12.72 36.85,15.26 U$1.D8 39.39,15.26 40.66,16.53 73.17,16.53 AH.G6
D15
  Top 0.254: 53.36,7.64 57.17,3.83 AH.G7 | U$1.D10 53.36,7.64 | 53.36,7.64 48.79,3.07 47.52,3.07 46.76,3.83 BL.G0 9.98,3.83
  Bottom 0.254: 7.59,11.5 BL.SPI-CS@B3 8.91,10.18 11.45,10.18 12.72,8.91 12.72,5.1 11.45,3.83 BL.G0 9.98,3.83
EN  (via drill 0.38)
  Top 0.254: U2.3 27.95,46.13 28.34,45.74 32.91,45.74 35.2,48.03 35.2,50.95 v35.33,51.07 | v46.25,51.07 v52.34,51.07
  Bottom 0.254: PSW1.2 70.76,49.3 69.74,48.28 63.52,48.28 60.73,51.07 v52.34,51.07 | v35.33,51.07 v46.25,51.07
GND  (via drill 0.38)
  Top 0.406: PWR.GND 15.44,46.3 v15.89,46.76
  Top 0.61: U2.2 28.9,48.23 v28.85,48.28 27.2,48.28 26.69,47.77 26.69,45.74 26.37,45.42 C1.2 24.95,42.54 C2.2 24.91,42.37 24.91,41.8 25.17,41.55 C3.2 26.31,41.16 U1.2 | v60.98,29.23 57.17,29.23 v55.9,30.5 | v60.98,22.88 v60.98,17.42 | v60.98,15.64 v60.98,12.47 | v60.98,10.94 60.98,8.28 | v24.4,35.45 25.38,35.45 R6.2 25.51,32.95 26.69,31.77 34.31,31.77 35.58,33.04 U$1.GND1 | PSW1.3 68.85,46.76 v72.41,43.2 | R2.1 21.36,35.45 v21.48,35.33 | v48.53,4.08 48.53,6.12 v48.79,6.37 | v42.56,7.64 42.56,9.55 U$1.GND4 | U$1.GND2 U$1.GND3 | v55.9,36.85 v55.9,39.39
  Top 0.813: C3.2 C4.1
  Bottom 0.406: v15.89,46.76 16.53,46.76
  Bottom 0.61: v72.41,43.2 71.14,43.2 | 60.98,24.15 61.03,24.2 83.28,24.2 AH.GND@G | 60.98,24.15 v60.98,29.23 | v55.9,30.5 55.9,35.58 | 60.98,24.15 v60.98,22.88 | v60.98,17.42 v60.98,15.64 | v60.98,12.47 v60.98,10.94 | v21.48,35.33 24.28,35.33 v24.4,35.45 | v28.85,48.28 21.99,48.28 v21.86,48.41
  pour Bottom: -1.25,8.4 -1.25,47.01 6.37,47.01 6.37,55.14 85.95,55.14 85.95,44.47 94.92,44.47 94.92,8.91 85.95,8.91 85.95,-1.76 7.64,-1.76 7.64,8.4
I2C-SCL  (via drill 0.38)
  Top 0.254: v16.53,17.8 25.42,26.69 | 25.42,26.69 27.96,29.23 41.93,29.23 43.2,27.96 47.01,27.96 | 91.21,33.04 90.95,33.29 90.95,36.09 90.19,36.85 AL.I2C-SCL@B5 84.6,35.58 67.33,35.58 66.06,34.31 66.06,27.96 64.79,26.69 48.28,26.69 47.01,27.96 | 47.01,27.96 U$1.A5 | R7.1 24.15,27.96 25.42,26.69 | v4.21,22.88 4.21,19.96 BL.I2C-SCL@B5
  Top 0.305: v87.65,15.26 89.68,15.26 91.21,16.78 91.21,33.04
  Bottom 0.254: BL.I2C-SCL@B5 8.91,17.8 v16.53,17.8 | BH.I2C-SCL@B5 5.1,44.47 3.83,43.2 3.83,38.12 1.29,35.58 1.29,25.8 v4.21,22.88
  Bottom 0.305: AH.I2C-SCL@B5 86.38,8.91 87.65,10.18 v87.65,15.26
I2C-SDA  (via drill 0.38)
  Top 0.254: v4.85,28.21 3.58,26.94 3.58,16.66 6.37,13.86 7.51,13.86 BL.I2C-SDA@B4 8.91,15.26 15.26,15.26 v26.69,26.69 44.47,26.69 v44.98,27.2 | v5.1,33.29 v5.1,35.58 | v44.98,28.72 49.68,33.42 51.2,33.42 52.09,32.53 52.09,30.88 51.2,29.99 51.2,29.61 U$1.A4 54.63,29.23 55.9,27.96 63.52,27.96 64.79,29.23 64.79,35.58 69.87,40.66 84.6,40.66 AL.I2C-SDA@B4 | v89.94,35.07 90.44,34.56 v90.44,17.29 | v89.56,10.31 87.02,10.31 AH.I2C-SDA@B4 | R4.1 21.61,26.31 v22.12,25.8
  Bottom 0.254: v4.85,28.21 4.85,33.04 v5.1,33.29 | v5.1,35.58 5.1,40.91 6.12,41.93 BH.I2C-SDA@B4 | v44.98,27.2 v44.98,28.72 | v89.94,35.07 89.94,38.12 88.67,39.39 AL.I2C-SDA@B4 86.15,39.39 | v90.44,17.29 90.44,16.15 89.56,15.26 v89.56,10.31 | v22.12,25.8 25.8,25.8 v26.69,26.69
N$1  (via drill 0.38)
  Top 0.254: v38.76,47.39 36.34,44.98 36.34,43.84 34.69,42.18 32.19,42.18 R1.1 | CHG.C 38.3,49.73 v38.76,50.19
  Bottom 0.254: v38.76,47.39 v38.76,50.19
N$2
  Top 0.61: R2.2 15.67,37.05 R5.1 15.67,39.45 R3.2
N$3
  Top 0.406: U1.1 31.63,39.93 R1.2
N$4
  Top 0.61: U1.5 27.26,35.48 R6.1
RESET  (via drill 0.38)
  Top 0.254: v27.45,33.04 28.72,34.31 31.77,34.31 33.04,35.58 U$1.RST1 50.82,35.58 | v15.26,33.04 12.97,33.04 | 50.82,35.58 U$1.RST 57.17,35.58 58.44,34.31 v60.22,34.31 | 92.22,33.8 v91.71,34.31 | BL.RESET@B6 6.37,19.07 4.85,20.59 4.85,24.4 5.86,25.42 11.7,25.42 12.97,26.69 12.97,33.04 | BH.RESET@2 2.56,39.39 3.83,40.66 3.83,43.2 BH.RESET@B6 8.91,45.74 8.91,43.71 9.42,43.2 11.96,43.2 12.97,42.18 12.97,33.04 | v90.32,9.54 90.32,9.42 87.27,6.37 AH.RESET@B6 | U$1.DTR 50.82,41.93 50.82,35.58
  Top 0.305: AH.RESET@2 92.22,33.8
  Bottom 0.254: v27.45,33.04 v15.26,33.04 | v60.22,34.31 80.54,34.31 81.81,33.04 84.6,33.04 AL.RESET@B6 | AL.RESET@B6 v91.71,34.31 90.7,35.33 90.7,41.17 91.46,41.93 AL.RESET@2 | 86.15,34.31 AL.RESET@B6 | BL.RESET@2 2.56,12.72 2.56,15.64 1.92,16.28 1.92,17.8 3.2,19.07 BL.RESET@B6 | AH.RESET@2 90.83,13.99 90.32,13.48 v90.32,9.54
SPI-CS1  (via drill 0.38)
  Top 0.254: U$1.D4 v50.82,25.42 | v59.96,33.04 60.85,32.15 62.63,32.15 63.27,32.79 63.27,37.87 67.33,41.93 81.3,41.93 82.57,43.2 84.6,43.2 AL.SPI-CS@B3
  Bottom 0.254: v59.96,33.04 58.95,32.02 58.95,28.21 57.42,26.69 52.09,26.69 v50.82,25.42
SPI-MISO  (via drill 0.38)
  Top 0.254: BH.SPI-MISO@B0 2.56,31.77 1.29,30.5 1.29,16.53 3.83,13.99 3.83,7.64 BL.SPI-MISO@B0 | v92.98,25.93 92.98,36.34 90.95,38.37 90.95,44.47 AL.SPI-MISO@B0 | v88.67,5.61 87.4,4.34 87.4,3.07 86.89,2.56 51.07,2.56 50.31,1.8 45.74,1.8 44.98,2.56 8.91,2.56 BL.SPI-MISO@B0 | BL.SPI-MISO@B0 7.01,3.83
  Bottom 0.254: v92.98,25.93 90.95,25.93 86.63,21.61 | 86.63,21.61 AH.SPI-MISO@B0 | 86.14,21.61 AH.SPI-MISO@B0 | AH.SPI-MISO@B0 84.6,20.34 73.68,20.34 71.65,18.31 58.69,18.31 58.19,17.8 U$1.D12 | 86.63,21.61 86.63,21.23 88.28,19.58 88.28,5.99 v88.67,5.61
SPI-MOSI  (via drill 0.38)
  Top 0.254: v30.5,7.64 8.91,7.64 BL.SPI-MOSI@B1 6.37,6.37 5.1,7.64 5.1,13.86 2.05,16.91 2.05,29.48 v2.56,29.99 | v40.66,7.64 40.66,13.99 41.93,15.26 U$1.D11 58.44,15.26 v59.71,13.99 | v88.16,35.58 88.41,35.33 88.41,33.29 88.92,32.79 88.92,19.7 88.28,19.07 AH.SPI-MOSI@B1 | AL.SPI-MOSI@B1 84.6,45.74 84.6,43.96 85.36,43.2 86.38,43.2 87.14,42.44 87.14,38.88 v88.16,37.87
  Bottom 0.254: v30.5,7.64 v40.66,7.64 | v2.56,29.99 2.56,33.55 3.32,34.31 BH.SPI-MOSI@B1 | v88.16,35.58 v88.16,37.87 | AH.SPI-MOSI@B1 84.6,17.8 82.57,17.8 78.76,13.99 v59.71,13.99
SPI-SCK  (via drill 0.38)
  Top 0.254: v69.87,19.07 v73.68,19.07 | v78.76,19.07 80.03,17.8 84.6,17.8 AH.SPI-SCK@B2 88.92,16.53 89.68,17.29 89.68,33.04 89.17,33.55 v89.17,36.09 | BL.SPI-SCK@B2 8.91,10.18 13.99,10.18 21.61,17.8 34.31,17.8 35.58,19.07 49.55,19.07 50.82,20.34 U$1.D13 | v3.83,29.48 2.81,28.47 v2.81,17.42 | v4.08,33.29 4.08,36.34 4.59,36.85 BH.SPI-SCK@B2 | AL.SPI-SCK@B2 87.4,44.47 88.03,43.84 88.03,40.02 89.17,38.88 v89.17,37.61
  Bottom 0.254: v73.68,19.07 v78.76,19.07 | v3.83,29.48 3.83,33.04 v4.08,33.29 | v89.17,36.09 v89.17,37.61 | v2.81,17.42 2.81,16.28 6.37,12.72 6.37,10.18 BL.SPI-SCK@B2 | U$1.D13 55.01,20.34 55.9,21.23 67.71,21.23 v69.87,19.07
VBAT  (via drill 0.38)
  Top 0.61: U1.3 23.61,39.93 22.88,40.66 | 22.88,40.66 v22.88,40.37 | D1.A 28.27,50.82 JP1.2 | R5.2 18.47,40.09 v18.75,40.37 | 22.88,40.66 22.88,42.37 C2.1 23.01,42.5 23.01,43.58 23.39,43.96 23.39,49.17 v23.52,49.3
  Bottom 0.61: v18.75,40.37 v22.88,40.37 | v23.52,49.3 25.17,49.3 25.55,49.68 25.55,50.8 JP1.2

### Text on the board
bPlace: Gadget Box - Mini Pro / Copyright 2016 / Gadget Factory, LLC / Version 1.2.1 | To get started visit: / GadgetBox.GadgetFactory.net